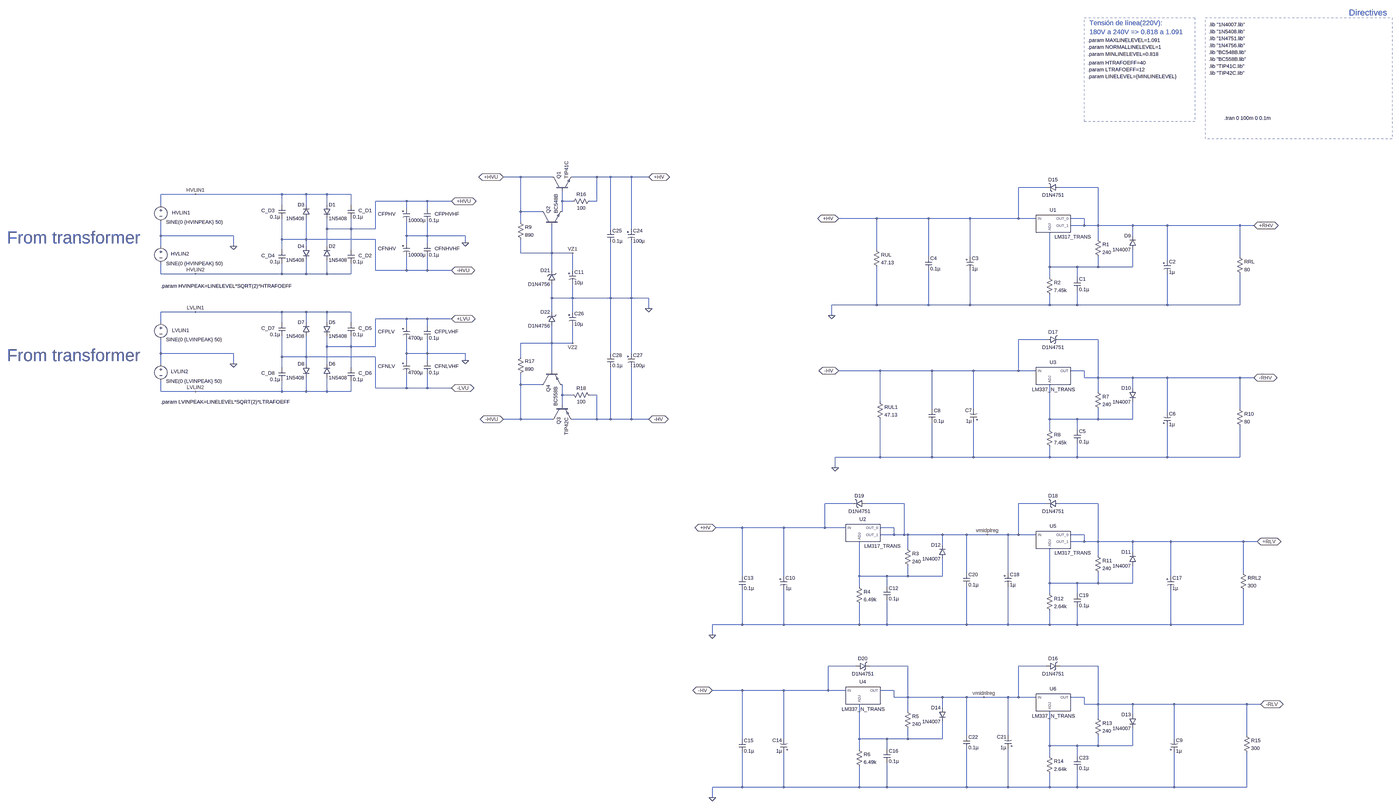
[diagram p0: schematic power_supply_V_1.0b.asc, whole sheet]
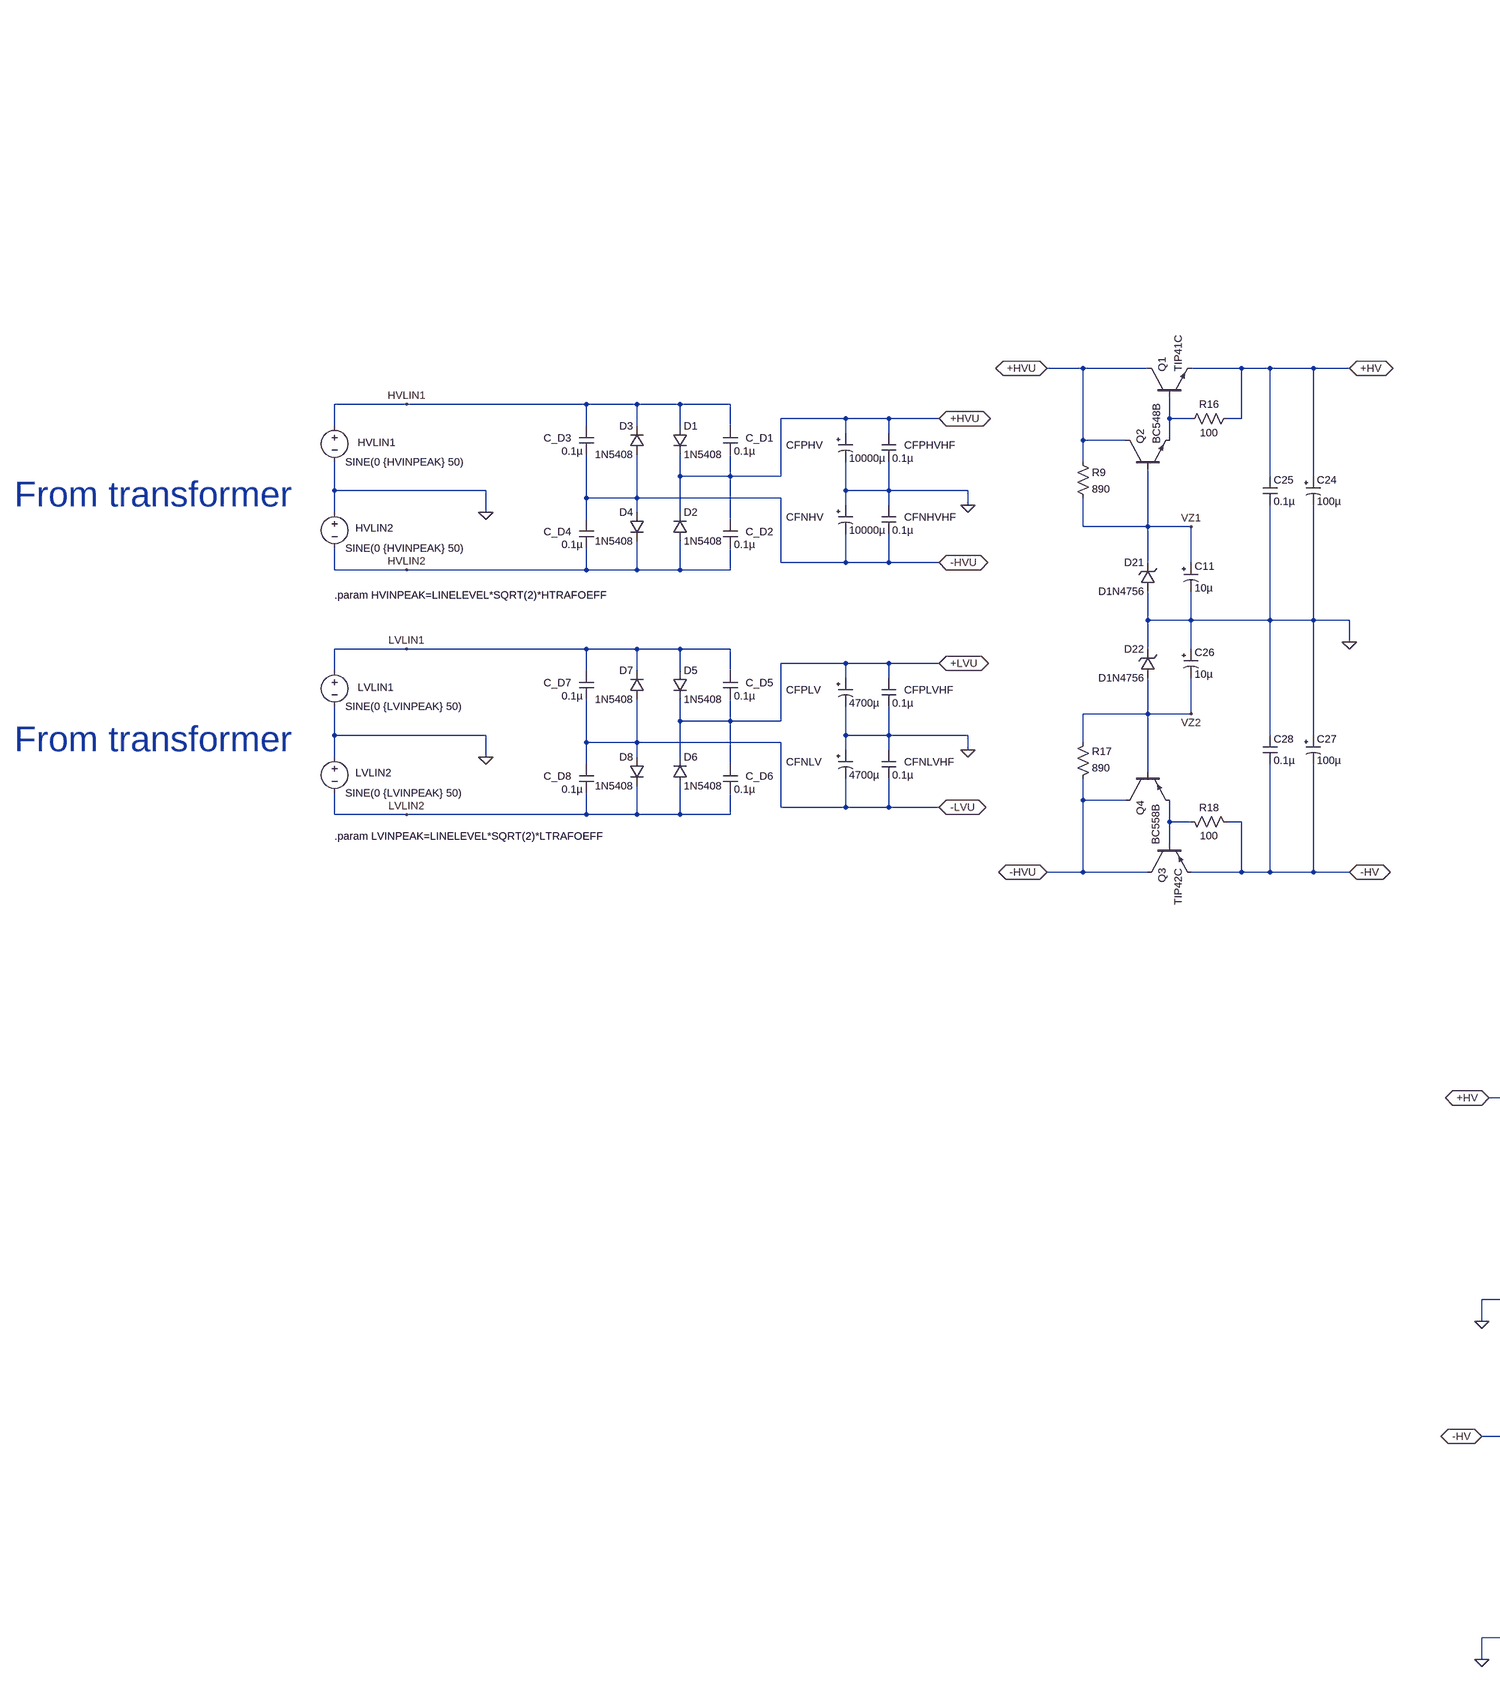
[diagram p1: schematic power_supply_V_1.0b.asc, part, row 1 of 1, column 1 of 2]
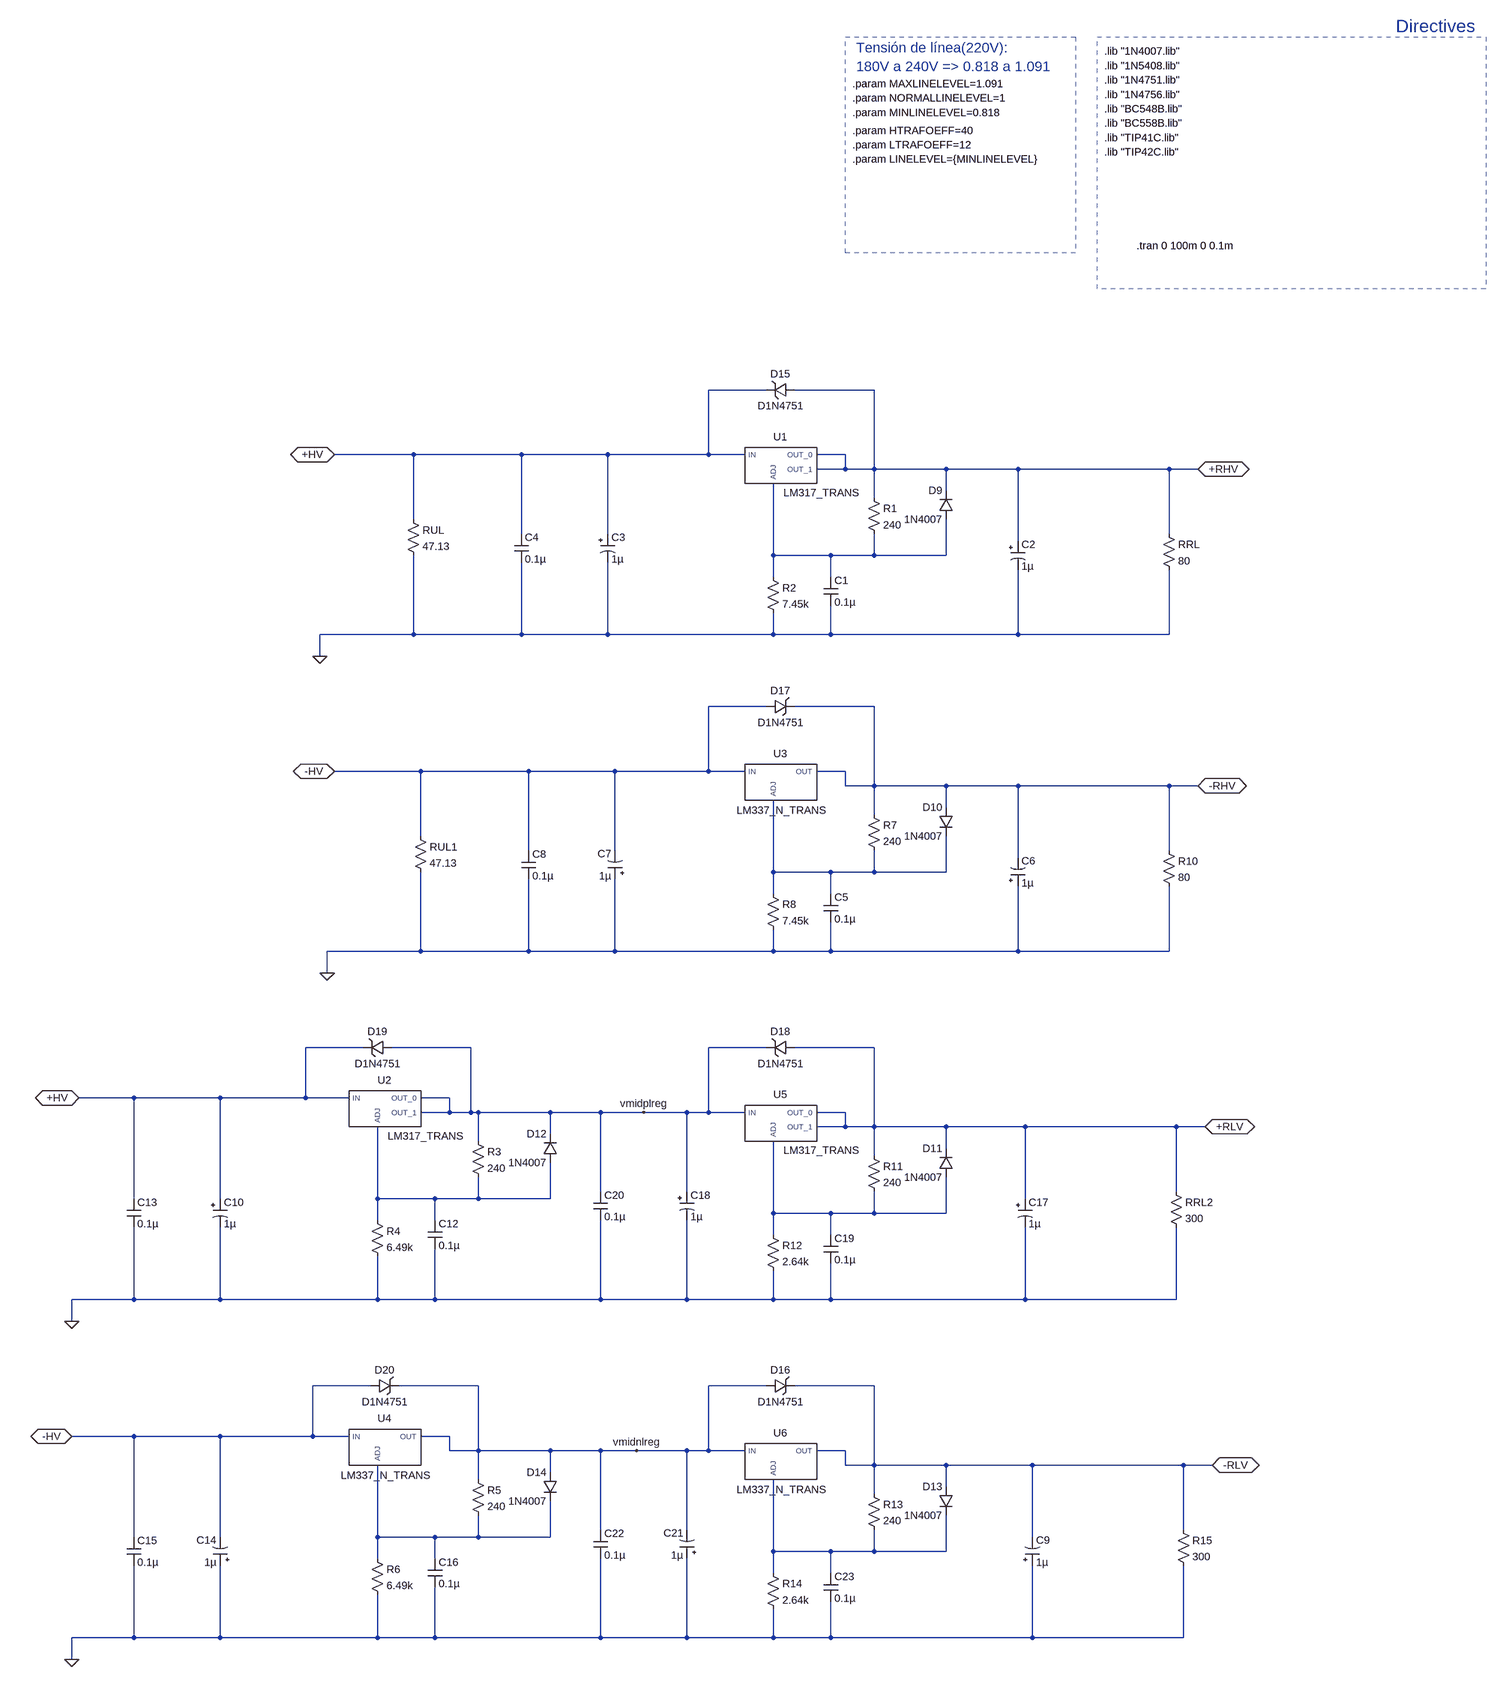
[diagram p2: schematic power_supply_V_1.0b.asc, part, row 1 of 1, column 2 of 2]
power_supply_V_1.0b.asc, the LTspice schematic file:
Version 4
SHEET 1 5728 3116
WIRE 416 -736 336 -736
WIRE 560 -736 416 -736
WIRE 768 -736 656 -736
WIRE 832 -736 768 -736
WIRE 928 -736 832 -736
WIRE 1008 -736 928 -736
WIRE 3088 -688 2960 -688
WIRE 3328 -688 3152 -688
WIRE -1088 -656 -1248 -656
WIRE -688 -656 -1088 -656
WIRE -576 -656 -688 -656
WIRE -480 -656 -576 -656
WIRE -368 -656 -480 -656
WIRE -112 -624 -256 -624
WIRE -16 -624 -112 -624
WIRE 96 -624 -16 -624
WIRE 608 -624 608 -672
WIRE 656 -624 608 -624
WIRE 768 -624 768 -736
WIRE 768 -624 736 -624
WIRE -1248 -608 -1248 -656
WIRE -688 -608 -688 -656
WIRE -576 -608 -576 -656
WIRE -480 -608 -480 -656
WIRE -368 -608 -368 -656
WIRE -112 -592 -112 -624
WIRE -16 -592 -16 -624
WIRE 416 -576 416 -736
WIRE 512 -576 416 -576
WIRE 608 -576 608 -624
WIRE 2304 -544 2128 -544
WIRE 2544 -544 2304 -544
WIRE 2736 -544 2544 -544
WIRE 2960 -544 2960 -688
WIRE 2960 -544 2736 -544
WIRE 3040 -544 2960 -544
WIRE 3264 -544 3200 -544
WIRE 416 -528 416 -576
WIRE 3264 -512 3264 -544
WIRE 3264 -512 3200 -512
WIRE 3328 -512 3328 -688
WIRE 3328 -512 3264 -512
WIRE 3488 -512 3328 -512
WIRE 3648 -512 3488 -512
WIRE 3984 -512 3648 -512
WIRE 4048 -512 3984 -512
WIRE -480 -496 -480 -544
WIRE -368 -496 -368 -544
WIRE -368 -496 -480 -496
WIRE -256 -496 -256 -624
WIRE -256 -496 -368 -496
WIRE 832 -496 832 -736
WIRE 928 -496 928 -736
WIRE -1248 -464 -1248 -528
WIRE -912 -464 -1248 -464
WIRE -112 -464 -112 -528
WIRE -16 -464 -16 -528
WIRE -16 -464 -112 -464
WIRE 160 -464 -16 -464
WIRE 3488 -464 3488 -512
WIRE -688 -448 -688 -544
WIRE -576 -448 -576 -544
WIRE -576 -448 -688 -448
WIRE -256 -448 -576 -448
WIRE 3328 -448 3328 -512
WIRE -112 -432 -112 -464
WIRE -16 -432 -16 -464
WIRE 160 -432 160 -464
WIRE -1248 -416 -1248 -464
WIRE -912 -416 -912 -464
WIRE -576 -416 -576 -448
WIRE -480 -416 -480 -496
WIRE -688 -400 -688 -448
WIRE -368 -400 -368 -496
WIRE 2304 -400 2304 -544
WIRE 416 -384 416 -448
WIRE 560 -384 560 -512
WIRE 560 -384 416 -384
WIRE 656 -384 560 -384
WIRE 2544 -368 2544 -544
WIRE 2736 -368 2736 -544
WIRE 3984 -368 3984 -512
WIRE 3648 -352 3648 -512
WIRE 3104 -320 3104 -480
WIRE 3232 -320 3104 -320
WIRE 3328 -320 3328 -368
WIRE 3328 -320 3232 -320
WIRE 3488 -320 3488 -400
WIRE 3488 -320 3328 -320
WIRE -256 -304 -256 -448
WIRE -112 -304 -112 -368
WIRE -112 -304 -256 -304
WIRE -16 -304 -16 -368
WIRE -16 -304 -112 -304
WIRE 96 -304 -16 -304
WIRE 560 -304 560 -384
WIRE 656 -304 656 -384
WIRE -1248 -288 -1248 -336
WIRE -1088 -288 -1248 -288
WIRE -688 -288 -688 -336
WIRE -688 -288 -1088 -288
WIRE -576 -288 -576 -352
WIRE -576 -288 -688 -288
WIRE -480 -288 -480 -352
WIRE -480 -288 -576 -288
WIRE -368 -288 -368 -336
WIRE -368 -288 -480 -288
WIRE 3104 -272 3104 -320
WIRE 3232 -272 3232 -320
WIRE 560 -176 560 -240
WIRE 656 -176 656 -240
WIRE 656 -176 560 -176
WIRE 832 -176 832 -432
WIRE 832 -176 656 -176
WIRE 928 -176 928 -432
WIRE 928 -176 832 -176
WIRE 1008 -176 928 -176
WIRE 2304 -144 2304 -320
WIRE 2304 -144 2096 -144
WIRE 2544 -144 2544 -304
WIRE 2544 -144 2304 -144
WIRE 2736 -144 2736 -304
WIRE 2736 -144 2544 -144
WIRE 3104 -144 3104 -192
WIRE 3104 -144 2736 -144
WIRE 3232 -144 3232 -208
WIRE 3232 -144 3104 -144
WIRE 3648 -144 3648 -288
WIRE 3648 -144 3232 -144
WIRE 3984 -144 3984 -288
WIRE 3984 -144 3648 -144
WIRE 1008 -128 1008 -176
WIRE -1088 -112 -1248 -112
WIRE -688 -112 -1088 -112
WIRE -576 -112 -688 -112
WIRE -480 -112 -576 -112
WIRE -368 -112 -480 -112
WIRE 560 -112 560 -176
WIRE 656 -112 656 -176
WIRE 2096 -96 2096 -144
WIRE -112 -80 -256 -80
WIRE -16 -80 -112 -80
WIRE 96 -80 -16 -80
WIRE -1248 -64 -1248 -112
WIRE -688 -64 -688 -112
WIRE -576 -64 -576 -112
WIRE -480 -64 -480 -112
WIRE -368 -64 -368 -112
WIRE -112 -48 -112 -80
WIRE -16 -48 -16 -80
WIRE 3088 16 2960 16
WIRE 3328 16 3152 16
WIRE 560 32 560 -48
WIRE 560 32 416 32
WIRE 656 32 656 -48
WIRE 656 32 560 32
WIRE -480 48 -480 0
WIRE -368 48 -368 0
WIRE -368 48 -480 48
WIRE -256 48 -256 -80
WIRE -256 48 -368 48
WIRE -1248 80 -1248 16
WIRE -912 80 -1248 80
WIRE -112 80 -112 16
WIRE -16 80 -16 16
WIRE -16 80 -112 80
WIRE 160 80 -16 80
WIRE 832 80 832 -176
WIRE 928 80 928 -176
WIRE -688 96 -688 0
WIRE -576 96 -576 0
WIRE -576 96 -688 96
WIRE -256 96 -576 96
WIRE 416 96 416 32
WIRE -112 112 -112 80
WIRE -16 112 -16 80
WIRE 160 112 160 80
WIRE -1248 128 -1248 80
WIRE -912 128 -912 80
WIRE -576 128 -576 96
WIRE -480 128 -480 48
WIRE -688 144 -688 96
WIRE -368 144 -368 48
WIRE 560 160 560 32
WIRE 2320 160 2128 160
WIRE 2560 160 2320 160
WIRE 2752 160 2560 160
WIRE 2960 160 2960 16
WIRE 2960 160 2752 160
WIRE 3040 160 2960 160
WIRE 3264 160 3200 160
WIRE 3264 192 3264 160
WIRE 3328 192 3328 16
WIRE 3328 192 3264 192
WIRE 3488 192 3328 192
WIRE 3648 192 3488 192
WIRE 3984 192 3648 192
WIRE 4048 192 3984 192
WIRE 416 224 416 176
WIRE 512 224 416 224
WIRE -256 240 -256 96
WIRE -112 240 -112 176
WIRE -112 240 -256 240
WIRE -16 240 -16 176
WIRE -16 240 -112 240
WIRE 96 240 -16 240
WIRE 3488 240 3488 192
WIRE -1248 256 -1248 208
WIRE -1088 256 -1248 256
WIRE -688 256 -688 208
WIRE -688 256 -1088 256
WIRE -576 256 -576 192
WIRE -576 256 -688 256
WIRE -480 256 -480 192
WIRE -480 256 -576 256
WIRE -368 256 -368 208
WIRE -368 256 -480 256
WIRE 3328 256 3328 192
WIRE 608 272 608 224
WIRE 656 272 608 272
WIRE 768 272 736 272
WIRE 2320 304 2320 160
WIRE 608 320 608 272
WIRE 2560 336 2560 160
WIRE 2752 336 2752 160
WIRE 3984 336 3984 192
WIRE 3648 352 3648 192
WIRE 416 384 416 224
WIRE 416 384 336 384
WIRE 560 384 416 384
WIRE 768 384 768 272
WIRE 768 384 656 384
WIRE 832 384 832 144
WIRE 832 384 768 384
WIRE 928 384 928 144
WIRE 928 384 832 384
WIRE 1008 384 928 384
WIRE 3104 384 3104 224
WIRE 3232 384 3104 384
WIRE 3328 384 3328 336
WIRE 3328 384 3232 384
WIRE 3488 384 3488 304
WIRE 3488 384 3328 384
WIRE 3104 432 3104 384
WIRE 3232 432 3232 384
WIRE 2320 560 2320 384
WIRE 2320 560 2112 560
WIRE 2560 560 2560 400
WIRE 2560 560 2320 560
WIRE 2752 560 2752 400
WIRE 2752 560 2560 560
WIRE 3104 560 3104 512
WIRE 3104 560 2752 560
WIRE 3232 560 3232 496
WIRE 3232 560 3104 560
WIRE 3648 560 3648 416
WIRE 3648 560 3232 560
WIRE 3984 560 3984 416
WIRE 3984 560 3648 560
WIRE 2112 608 2112 560
WIRE 2192 864 2064 864
WIRE 2432 864 2256 864
WIRE 3088 864 2960 864
WIRE 3328 864 3152 864
WIRE 1664 976 1472 976
WIRE 1856 976 1664 976
WIRE 2064 976 2064 864
WIRE 2064 976 1856 976
WIRE 2160 976 2064 976
WIRE 2384 976 2320 976
WIRE 2384 1008 2384 976
WIRE 2384 1008 2320 1008
WIRE 2432 1008 2432 864
WIRE 2432 1008 2384 1008
WIRE 2448 1008 2432 1008
WIRE 2608 1008 2448 1008
WIRE 2720 1008 2608 1008
WIRE 2816 1008 2720 1008
WIRE 2912 1008 2816 1008
WIRE 2960 1008 2960 864
WIRE 2960 1008 2912 1008
WIRE 3040 1008 2960 1008
WIRE 3264 1008 3200 1008
WIRE 3264 1040 3264 1008
WIRE 3264 1040 3200 1040
WIRE 3328 1040 3328 864
WIRE 3328 1040 3264 1040
WIRE 3488 1040 3328 1040
WIRE 3664 1040 3488 1040
WIRE 4000 1040 3664 1040
WIRE 4064 1040 4000 1040
WIRE 2608 1056 2608 1008
WIRE 2448 1072 2448 1008
WIRE 3488 1088 3488 1040
WIRE 3328 1104 3328 1040
WIRE 2720 1184 2720 1008
WIRE 2912 1184 2912 1008
WIRE 4000 1184 4000 1040
WIRE 1664 1200 1664 976
WIRE 1856 1200 1856 976
WIRE 2224 1200 2224 1040
WIRE 2352 1200 2224 1200
WIRE 2448 1200 2448 1152
WIRE 2448 1200 2352 1200
WIRE 2608 1200 2608 1120
WIRE 2608 1200 2448 1200
WIRE 3664 1200 3664 1040
WIRE 3104 1232 3104 1072
WIRE 3232 1232 3104 1232
WIRE 3328 1232 3328 1184
WIRE 3328 1232 3232 1232
WIRE 3488 1232 3488 1152
WIRE 3488 1232 3328 1232
WIRE 2224 1248 2224 1200
WIRE 2352 1248 2352 1200
WIRE 3104 1280 3104 1232
WIRE 3232 1280 3232 1232
WIRE 1664 1424 1664 1264
WIRE 1664 1424 1456 1424
WIRE 1856 1424 1856 1264
WIRE 1856 1424 1664 1424
WIRE 2224 1424 2224 1328
WIRE 2224 1424 1856 1424
WIRE 2352 1424 2352 1312
WIRE 2352 1424 2224 1424
WIRE 2720 1424 2720 1248
WIRE 2720 1424 2352 1424
WIRE 2912 1424 2912 1248
WIRE 2912 1424 2720 1424
WIRE 3104 1424 3104 1360
WIRE 3104 1424 2912 1424
WIRE 3232 1424 3232 1344
WIRE 3232 1424 3104 1424
WIRE 3664 1424 3664 1264
WIRE 3664 1424 3232 1424
WIRE 4000 1424 4000 1264
WIRE 4000 1424 3664 1424
WIRE 1456 1472 1456 1424
WIRE 2208 1616 2080 1616
WIRE 2448 1616 2272 1616
WIRE 3088 1616 2960 1616
WIRE 3328 1616 3152 1616
WIRE 1664 1728 1456 1728
WIRE 1856 1728 1664 1728
WIRE 2080 1728 2080 1616
WIRE 2080 1728 1856 1728
WIRE 2160 1728 2080 1728
WIRE 2384 1728 2320 1728
WIRE 2384 1760 2384 1728
WIRE 2448 1760 2448 1616
WIRE 2448 1760 2384 1760
WIRE 2608 1760 2448 1760
WIRE 2720 1760 2608 1760
WIRE 2800 1760 2720 1760
WIRE 2912 1760 2800 1760
WIRE 2960 1760 2960 1616
WIRE 2960 1760 2912 1760
WIRE 3040 1760 2960 1760
WIRE 3264 1760 3200 1760
WIRE 3264 1792 3264 1760
WIRE 3328 1792 3328 1616
WIRE 3328 1792 3264 1792
WIRE 3488 1792 3328 1792
WIRE 3680 1792 3488 1792
WIRE 4016 1792 3680 1792
WIRE 4080 1792 4016 1792
WIRE 2608 1808 2608 1760
WIRE 2448 1824 2448 1760
WIRE 3488 1840 3488 1792
WIRE 3328 1856 3328 1792
WIRE 2720 1936 2720 1760
WIRE 2912 1936 2912 1760
WIRE 4016 1936 4016 1792
WIRE 1664 1952 1664 1728
WIRE 1856 1952 1856 1728
WIRE 2224 1952 2224 1792
WIRE 2352 1952 2224 1952
WIRE 2448 1952 2448 1904
WIRE 2448 1952 2352 1952
WIRE 2608 1952 2608 1872
WIRE 2608 1952 2448 1952
WIRE 3680 1952 3680 1792
WIRE 3104 1984 3104 1824
WIRE 3232 1984 3104 1984
WIRE 3328 1984 3328 1936
WIRE 3328 1984 3232 1984
WIRE 3488 1984 3488 1904
WIRE 3488 1984 3328 1984
WIRE 2224 2000 2224 1952
WIRE 2352 2000 2352 1952
WIRE 3104 2032 3104 1984
WIRE 3232 2032 3232 1984
WIRE 1664 2176 1664 2016
WIRE 1664 2176 1456 2176
WIRE 1856 2176 1856 2016
WIRE 1856 2176 1664 2176
WIRE 2224 2176 2224 2080
WIRE 2224 2176 1856 2176
WIRE 2352 2176 2352 2064
WIRE 2352 2176 2224 2176
WIRE 2720 2176 2720 2000
WIRE 2720 2176 2352 2176
WIRE 2912 2176 2912 2000
WIRE 2912 2176 2720 2176
WIRE 3104 2176 3104 2112
WIRE 3104 2176 2912 2176
WIRE 3232 2176 3232 2096
WIRE 3232 2176 3104 2176
WIRE 3680 2176 3680 2016
WIRE 3680 2176 3232 2176
WIRE 4016 2176 4016 2016
WIRE 4016 2176 3680 2176
WIRE 1456 2224 1456 2176
FLAG -1088 -656 HVLIN1
FLAG -1088 -288 HVLIN2
FLAG -912 -416 0
FLAG 96 -624 +HVU
IOPIN 96 -624 BiDir
FLAG 2128 -544 +HV
IOPIN 2128 -544 BiDir
FLAG 96 -304 -HVU
IOPIN 96 -304 BiDir
FLAG 2128 160 -HV
IOPIN 2128 160 BiDir
FLAG 1456 1728 -HV
IOPIN 1456 1728 BiDir
FLAG 1472 976 +HV
IOPIN 1472 976 BiDir
FLAG 160 -432 0
FLAG 2816 1008 vmidplreg
FLAG 2800 1760 vmidnlreg
FLAG -1088 -112 LVLIN1
FLAG -1088 256 LVLIN2
FLAG -912 128 0
FLAG 96 -80 +LVU
IOPIN 96 -80 BiDir
FLAG 96 240 -LVU
IOPIN 96 240 BiDir
FLAG 160 112 0
FLAG 2096 -96 0
FLAG 4048 -512 +RHV
IOPIN 4048 -512 BiDir
FLAG 2112 608 0
FLAG 4048 192 -RHV
IOPIN 4048 192 BiDir
FLAG 1456 1472 0
FLAG 4064 1040 +RLV
IOPIN 4064 1040 BiDir
FLAG 1456 2224 0
FLAG 4080 1792 -RLV
IOPIN 4080 1792 BiDir
FLAG 336 -736 +HVU
IOPIN 336 -736 BiDir
FLAG 1008 -736 +HV
IOPIN 1008 -736 BiDir
FLAG 656 -384 VZ1
FLAG 336 384 -HVU
IOPIN 336 384 BiDir
FLAG 1008 384 -HV
IOPIN 1008 384 BiDir
FLAG 656 32 VZ2
FLAG 1008 -128 0
SYMBOL voltage -1248 -624 R0
WINDOW 123 0 0 Left 2
WINDOW 39 0 0 Left 2
WINDOW 0 51 53 Left 2
SYMATTR InstName HVLIN1
SYMATTR Value SINE(0 {HVINPEAK} 50)
SYMBOL diode -496 -608 R0
SYMATTR InstName D1
SYMATTR Value 1N5408
SYMBOL diode -496 -352 M180
WINDOW 0 24 64 Left 2
WINDOW 3 24 0 Left 2
SYMATTR InstName D2
SYMATTR Value 1N5408
SYMBOL polcap -128 -592 R0
WINDOW 0 -116 27 Left 2
WINDOW 3 24 56 Left 2
SYMATTR InstName CFPHV
SYMATTR Value 10000µ
SYMATTR Description Capacitor
SYMATTR Type cap
SYMATTR SpiceLine V=35 Irms=1.45 Rser=0.044 Lser=0 mfg="Nichicon" pn="UPR1V222MRH" type="Al electrolytic"
SYMBOL cap -32 -592 R0
WINDOW 0 50 27 Left 2
SYMATTR InstName CFPHVHF
SYMATTR Value 0.1µ
SYMATTR SpiceLine V=4 Irms=1.62 Rser=0.0464862 Lser=0 mfg="KEMET" pn="C0402C104K7PAC" type="X5R"
SYMBOL diode -560 -544 R180
WINDOW 0 24 64 Left 2
WINDOW 3 24 0 Left 2
SYMATTR InstName D3
SYMATTR Value 1N5408
SYMBOL diode -560 -416 M0
SYMATTR InstName D4
SYMATTR Value 1N5408
SYMBOL voltage -1248 -432 R0
WINDOW 123 0 0 Left 2
WINDOW 39 0 0 Left 2
WINDOW 0 46 51 Left 2
SYMATTR InstName HVLIN2
SYMATTR Value SINE(0 {HVINPEAK} 50)
SYMBOL polcap -128 -432 R0
WINDOW 0 -116 27 Left 2
WINDOW 3 24 56 Left 2
SYMATTR InstName CFNHV
SYMATTR Value 10000µ
SYMATTR Description Capacitor
SYMATTR Type cap
SYMATTR SpiceLine V=35 Irms=1.45 Rser=0.044 Lser=0 mfg="Nichicon" pn="UPR1V222MRH" type="Al electrolytic"
SYMBOL cap -32 -432 R0
WINDOW 0 50 27 Left 2
SYMATTR InstName CFNHVHF
SYMATTR Value 0.1µ
SYMATTR SpiceLine V=4 Irms=1.62 Rser=0.0464862 Lser=0 mfg="KEMET" pn="C0402C104K7PAC" type="X5R"
SYMBOL LM317_TRANS 3120 -528 R0
WINDOW 3 91 53 Top 2
SYMATTR InstName U1
SYMBOL diode 3504 -400 R180
WINDOW 0 24 64 Left 2
WINDOW 3 24 0 Left 2
SYMATTR InstName D9
SYMATTR Value 1N4007
SYMBOL res 3312 -464 R0
SYMATTR InstName R1
SYMATTR Value 240
SYMBOL res 3088 -288 R0
SYMATTR InstName R2
SYMATTR Value 7.45k
SYMBOL polcap 3632 -352 R0
SYMATTR InstName C2
SYMATTR Value 1µ
SYMBOL polcap 2720 -368 R0
SYMATTR InstName C3
SYMATTR Value 1µ
SYMBOL diode 3504 240 M0
SYMATTR InstName D10
SYMATTR Value 1N4007
SYMBOL res 3312 240 R0
SYMATTR InstName R7
SYMATTR Value 240
SYMBOL res 3088 416 R0
SYMATTR InstName R8
SYMATTR Value 7.45k
SYMBOL polcap 3632 416 M180
WINDOW 0 24 57 Left 2
WINDOW 3 24 8 Left 2
SYMATTR InstName C6
SYMATTR Value 1µ
SYMBOL res 3968 320 R0
SYMATTR InstName R10
SYMATTR Value 80
SYMBOL LM337_N_TRANS 3120 176 R0
SYMATTR InstName U3
SYMBOL res 3968 -384 R0
SYMATTR InstName RRL
SYMATTR Value 80
SYMBOL cap 3216 -272 R0
SYMATTR InstName C1
SYMATTR Value 0.1µ
SYMBOL cap 2528 -368 R0
SYMATTR InstName C4
SYMATTR Value 0.1µ
SYMBOL res 2288 -416 R0
SYMATTR InstName RUL
SYMATTR Value 47.13
SYMBOL polcap 2768 400 R180
WINDOW 0 24 57 Left 2
WINDOW 3 24 8 Left 2
SYMATTR InstName C7
SYMATTR Value 1µ
SYMBOL cap 2544 336 R0
SYMATTR InstName C8
SYMATTR Value 0.1µ
SYMBOL res 2304 288 R0
SYMATTR InstName RUL1
SYMATTR Value 47.13
SYMBOL cap 3216 432 R0
SYMATTR InstName C5
SYMATTR Value 0.1µ
SYMBOL LM317_TRANS 2240 992 R0
WINDOW 3 91 53 Top 2
SYMATTR InstName U2
SYMBOL diode 2624 1120 R180
WINDOW 0 24 64 Left 2
WINDOW 3 24 0 Left 2
SYMATTR InstName D12
SYMATTR Value 1N4007
SYMBOL res 2432 1056 R0
SYMATTR InstName R3
SYMATTR Value 240
SYMBOL res 2208 1232 R0
SYMATTR InstName R4
SYMATTR Value 6.49k
SYMBOL polcap 1840 1200 R0
SYMATTR InstName C10
SYMATTR Value 1µ
SYMBOL diode 2624 1808 M0
SYMATTR InstName D14
SYMATTR Value 1N4007
SYMBOL res 2432 1808 R0
SYMATTR InstName R5
SYMATTR Value 240
SYMBOL res 2208 1984 R0
SYMATTR InstName R6
SYMATTR Value 6.49k
SYMBOL LM337_N_TRANS 2240 1744 R0
SYMATTR InstName U4
SYMBOL cap 2336 1248 R0
SYMATTR InstName C12
SYMATTR Value 0.1µ
SYMBOL cap 1648 1200 R0
SYMATTR InstName C13
SYMATTR Value 0.1µ
SYMBOL polcap 1872 2016 R180
WINDOW 0 24 57 Left 2
WINDOW 3 24 8 Left 2
SYMATTR InstName C14
SYMATTR Value 1µ
SYMBOL cap 1648 1952 R0
SYMATTR InstName C15
SYMATTR Value 0.1µ
SYMBOL cap 2336 2000 R0
SYMATTR InstName C16
SYMATTR Value 0.1µ
SYMBOL LM317_TRANS 3120 1024 R0
WINDOW 3 91 53 Top 2
SYMATTR InstName U5
SYMBOL diode 3504 1152 R180
WINDOW 0 24 64 Left 2
WINDOW 3 24 0 Left 2
SYMATTR InstName D11
SYMATTR Value 1N4007
SYMBOL res 3312 1088 R0
SYMATTR InstName R11
SYMATTR Value 240
SYMBOL res 3088 1264 R0
SYMATTR InstName R12
SYMATTR Value 2.64k
SYMBOL polcap 3648 1200 R0
SYMATTR InstName C17
SYMATTR Value 1µ
SYMBOL polcap 2896 1184 R0
SYMATTR InstName C18
SYMATTR Value 1µ
SYMBOL res 3984 1168 R0
SYMATTR InstName RRL2
SYMATTR Value 300
SYMBOL cap 3216 1280 R0
SYMATTR InstName C19
SYMATTR Value 0.1µ
SYMBOL cap 2704 1184 R0
SYMATTR InstName C20
SYMATTR Value 0.1µ
SYMBOL diode 3504 1840 M0
SYMATTR InstName D13
SYMATTR Value 1N4007
SYMBOL res 3312 1840 R0
SYMATTR InstName R13
SYMATTR Value 240
SYMBOL res 3088 2016 R0
SYMATTR InstName R14
SYMATTR Value 2.64k
SYMBOL polcap 3664 2016 M180
WINDOW 0 24 57 Left 2
WINDOW 3 24 8 Left 2
SYMATTR InstName C9
SYMATTR Value 1µ
SYMBOL res 4000 1920 R0
SYMATTR InstName R15
SYMATTR Value 300
SYMBOL LM337_N_TRANS 3120 1776 R0
SYMATTR InstName U6
SYMBOL polcap 2928 2000 R180
WINDOW 0 24 57 Left 2
WINDOW 3 24 8 Left 2
SYMATTR InstName C21
SYMATTR Value 1µ
SYMBOL cap 2704 1936 R0
SYMATTR InstName C22
SYMATTR Value 0.1µ
SYMBOL cap 3216 2032 R0
SYMATTR InstName C23
SYMATTR Value 0.1µ
SYMBOL cap -384 -608 R0
WINDOW 0 50 27 Left 2
SYMATTR InstName C_D1
SYMATTR Value 0.1µ
SYMATTR SpiceLine V=4 Irms=1.62 Rser=0.0464862 Lser=0 mfg="KEMET" pn="C0402C104K7PAC" type="X5R"
SYMBOL cap -384 -400 R0
WINDOW 0 50 27 Left 2
SYMATTR InstName C_D2
SYMATTR Value 0.1µ
SYMATTR SpiceLine V=4 Irms=1.62 Rser=0.0464862 Lser=0 mfg="KEMET" pn="C0402C104K7PAC" type="X5R"
SYMBOL cap -672 -608 M0
WINDOW 0 50 27 Left 2
SYMATTR InstName C_D3
SYMATTR Value 0.1µ
SYMATTR SpiceLine V=4 Irms=1.62 Rser=0.0464862 Lser=0 mfg="KEMET" pn="C0402C104K7PAC" type="X5R"
SYMBOL cap -672 -400 M0
WINDOW 0 50 27 Left 2
SYMATTR InstName C_D4
SYMATTR Value 0.1µ
SYMATTR SpiceLine V=4 Irms=1.62 Rser=0.0464862 Lser=0 mfg="KEMET" pn="C0402C104K7PAC" type="X5R"
SYMBOL voltage -1248 -80 R0
WINDOW 123 0 0 Left 2
WINDOW 39 0 0 Left 2
WINDOW 0 51 53 Left 2
SYMATTR InstName LVLIN1
SYMATTR Value SINE(0 {LVINPEAK} 50)
SYMBOL diode -496 -64 R0
SYMATTR InstName D5
SYMATTR Value 1N5408
SYMBOL diode -496 192 M180
WINDOW 0 24 64 Left 2
WINDOW 3 24 0 Left 2
SYMATTR InstName D6
SYMATTR Value 1N5408
SYMBOL polcap -128 -48 R0
WINDOW 0 -116 27 Left 2
WINDOW 3 24 56 Left 2
SYMATTR InstName CFPLV
SYMATTR Value 4700µ
SYMATTR Description Capacitor
SYMATTR Type cap
SYMATTR SpiceLine V=35 Irms=1.45 Rser=0.044 Lser=0 mfg="Nichicon" pn="UPR1V222MRH" type="Al electrolytic"
SYMBOL cap -32 -48 R0
WINDOW 0 50 27 Left 2
SYMATTR InstName CFPLVHF
SYMATTR Value 0.1µ
SYMATTR SpiceLine V=4 Irms=1.62 Rser=0.0464862 Lser=0 mfg="KEMET" pn="C0402C104K7PAC" type="X5R"
SYMBOL diode -560 0 R180
WINDOW 0 24 64 Left 2
WINDOW 3 24 0 Left 2
SYMATTR InstName D7
SYMATTR Value 1N5408
SYMBOL diode -560 128 M0
SYMATTR InstName D8
SYMATTR Value 1N5408
SYMBOL voltage -1248 112 R0
WINDOW 123 0 0 Left 2
WINDOW 39 0 0 Left 2
WINDOW 0 46 51 Left 2
SYMATTR InstName LVLIN2
SYMATTR Value SINE(0 {LVINPEAK} 50)
SYMBOL polcap -128 112 R0
WINDOW 0 -116 27 Left 2
WINDOW 3 24 56 Left 2
SYMATTR InstName CFNLV
SYMATTR Value 4700µ
SYMATTR Description Capacitor
SYMATTR Type cap
SYMATTR SpiceLine V=35 Irms=1.45 Rser=0.044 Lser=0 mfg="Nichicon" pn="UPR1V222MRH" type="Al electrolytic"
SYMBOL cap -32 112 R0
WINDOW 0 50 27 Left 2
SYMATTR InstName CFNLVHF
SYMATTR Value 0.1µ
SYMATTR SpiceLine V=4 Irms=1.62 Rser=0.0464862 Lser=0 mfg="KEMET" pn="C0402C104K7PAC" type="X5R"
SYMBOL cap -384 -64 R0
WINDOW 0 50 27 Left 2
SYMATTR InstName C_D5
SYMATTR Value 0.1µ
SYMATTR SpiceLine V=4 Irms=1.62 Rser=0.0464862 Lser=0 mfg="KEMET" pn="C0402C104K7PAC" type="X5R"
SYMBOL cap -384 144 R0
WINDOW 0 50 27 Left 2
SYMATTR InstName C_D6
SYMATTR Value 0.1µ
SYMATTR SpiceLine V=4 Irms=1.62 Rser=0.0464862 Lser=0 mfg="KEMET" pn="C0402C104K7PAC" type="X5R"
SYMBOL cap -672 -64 M0
WINDOW 0 50 27 Left 2
SYMATTR InstName C_D7
SYMATTR Value 0.1µ
SYMATTR SpiceLine V=4 Irms=1.62 Rser=0.0464862 Lser=0 mfg="KEMET" pn="C0402C104K7PAC" type="X5R"
SYMBOL cap -672 144 M0
WINDOW 0 50 27 Left 2
SYMATTR InstName C_D8
SYMATTR Value 0.1µ
SYMATTR SpiceLine V=4 Irms=1.62 Rser=0.0464862 Lser=0 mfg="KEMET" pn="C0402C104K7PAC" type="X5R"
SYMBOL npn 560 -672 R270
SYMATTR InstName Q1
SYMATTR Value TIP41C
SYMBOL zener 3152 -704 R90
WINDOW 0 -4 32 VBottom 2
WINDOW 3 36 32 VTop 2
SYMATTR InstName D15
SYMATTR Value D1N4751
SYMBOL zener 3088 0 M90
WINDOW 0 -4 32 VBottom 2
WINDOW 3 36 32 VTop 2
SYMATTR InstName D17
SYMATTR Value D1N4751
SYMBOL zener 3152 848 R90
WINDOW 0 -4 32 VBottom 2
WINDOW 3 36 32 VTop 2
SYMATTR InstName D18
SYMATTR Value D1N4751
SYMBOL zener 2256 848 R90
WINDOW 0 -4 32 VBottom 2
WINDOW 3 36 32 VTop 2
SYMATTR InstName D19
SYMATTR Value D1N4751
SYMBOL zener 3088 1600 M90
WINDOW 0 -4 32 VBottom 2
WINDOW 3 36 32 VTop 2
SYMATTR InstName D16
SYMATTR Value D1N4751
SYMBOL zener 2208 1600 M90
WINDOW 0 -4 32 VBottom 2
WINDOW 3 36 32 VTop 2
SYMATTR InstName D20
SYMATTR Value D1N4751
SYMBOL zener 576 -240 R180
WINDOW 0 24 64 Left 2
WINDOW 3 24 0 Left 2
SYMATTR InstName D21
SYMATTR Value D1N4756
SYMBOL res 400 -544 R0
SYMATTR InstName R9
SYMATTR Value 890
SYMBOL npn 512 -512 R270
SYMATTR InstName Q2
SYMATTR Value BC548B
SYMBOL res 752 -640 R90
WINDOW 0 0 56 VBottom 2
WINDOW 3 32 56 VTop 2
SYMATTR InstName R16
SYMATTR Value 100
SYMBOL polcap 640 -304 R0
SYMATTR InstName C11
SYMATTR Value 10µ
SYMBOL polcap 912 -496 R0
SYMATTR InstName C24
SYMATTR Value 100µ
SYMBOL cap 816 -496 R0
SYMATTR InstName C25
SYMATTR Value 0.1µ
SYMBOL zener 576 -48 R180
WINDOW 0 24 64 Left 2
WINDOW 3 24 0 Left 2
SYMATTR InstName D22
SYMATTR Value D1N4756
SYMBOL res 400 192 M180
WINDOW 0 36 76 Left 2
WINDOW 3 36 40 Left 2
SYMATTR InstName R17
SYMATTR Value 890
SYMBOL res 752 288 M270
WINDOW 0 32 56 VTop 2
WINDOW 3 0 56 VBottom 2
SYMATTR InstName R18
SYMATTR Value 100
SYMBOL polcap 640 -112 R0
SYMATTR InstName C26
SYMATTR Value 10µ
SYMBOL polcap 912 80 R0
SYMATTR InstName C27
SYMATTR Value 100µ
SYMBOL cap 816 144 M180
WINDOW 0 24 56 Left 2
WINDOW 3 24 8 Left 2
SYMATTR InstName C28
SYMATTR Value 0.1µ
SYMBOL pnp 512 160 M90
WINDOW 0 66 32 Left 2
WINDOW 3 73 66 Left 2
SYMATTR InstName Q4
SYMATTR Value BC558B
SYMBOL pnp 560 320 M90
SYMATTR InstName Q3
SYMATTR Value TIP42C
TEXT -1960 -456 Left 6 ;From transformer
TEXT 3912 -1232 Left 2 !.tran 0 100m 0 0.1m
TEXT 3840 -1664 Left 2 !.lib "1N4007.lib"
TEXT 4488 -1720 Left 4 ;Directives
TEXT 3840 -1632 Left 2 !.lib "1N5408.lib"
TEXT 3840 -1600 Left 2 !.lib "1N4751.lib"
TEXT 3280 -1488 Left 2 !.param HTRAFOEFF=40
TEXT 3280 -1456 Left 2 !.param LTRAFOEFF=12
TEXT 3280 -1424 Left 2 !.param LINELEVEL={MINLINELEVEL}
TEXT 3288 -1672 Left 3 ;Tensión de línea(220V):\n180V a 240V => 0.818 a 1.091
TEXT 3280 -1592 Left 2 !.param MAXLINELEVEL=1.091
TEXT 3280 -1528 Left 2 !.param MINLINELEVEL=0.818
TEXT 3280 -1560 Left 2 !.param NORMALLINELEVEL=1
TEXT -1248 -232 Left 2 !.param HVINPEAK=LINELEVEL*SQRT(2)*HTRAFOEFF
TEXT -1960 88 Left 6 ;From transformer
TEXT -1248 304 Left 2 !.param LVINPEAK=LINELEVEL*SQRT(2)*LTRAFOEFF
TEXT 3840 -1568 Left 2 !.lib "1N4756.lib"
TEXT 3840 -1536 Left 2 !.lib "BC548B.lib"
TEXT 3840 -1504 Left 2 !.lib "BC558B.lib"
TEXT 3840 -1472 Left 2 !.lib "TIP41C.lib"
TEXT 3840 -1440 Left 2 !.lib "TIP42C.lib"
RECTANGLE Normal 4688 -1136 3824 -1696 3
RECTANGLE Normal 3776 -1216 3264 -1696 2

The netlist it stands for:
* power_supply_V_1.0b.asc
V§HVLIN1 HVLIN1 0 SINE(0 {HVINPEAK} 50)
D1 HVLIN1 +HVU 1N5408
D2 HVLIN2 +HVU 1N5408
CFPHV +HVU 0 10000µ V=35 Irms=1.45 Rser=0.044 Lser=0 mfg="Nichicon" pn="UPR1V222MRH" type="Al electrolytic"
CFPHVHF +HVU 0 0.1µ V=4 Irms=1.62 Rser=0.0464862 Lser=0 mfg="KEMET" pn="C0402C104K7PAC" type="X5R"
D3 -HVU HVLIN1 1N5408
D4 -HVU HVLIN2 1N5408
V§HVLIN2 0 HVLIN2 SINE(0 {HVINPEAK} 50)
CFNHV 0 -HVU 10000µ V=35 Irms=1.45 Rser=0.044 Lser=0 mfg="Nichicon" pn="UPR1V222MRH" type="Al electrolytic"
CFNHVHF 0 -HVU 0.1µ V=4 Irms=1.62 Rser=0.0464862 Lser=0 mfg="KEMET" pn="C0402C104K7PAC" type="X5R"
XU1 +HV N002 +RHV +RHV LM317_TRANS  ; pins IN ADJ OUT_0 OUT_1
D9 N002 +RHV 1N4007
R1 +RHV N002 240
R2 N002 0 7.45k
C2 +RHV 0 1µ
C3 +HV 0 1µ
D10 -RHV N004 1N4007
R7 -RHV N004 240
R8 N004 0 7.45k
C6 0 -RHV 1µ
R10 -RHV 0 80
XU3 -HV N004 -RHV LM337_N_TRANS  ; pins IN ADJ OUT
RRL +RHV 0 80
C1 N002 0 0.1µ
C4 +HV 0 0.1µ
RUL +HV 0 47.13
C7 0 -HV 1µ
C8 -HV 0 0.1µ
RUL1 -HV 0 47.13
C5 N004 0 0.1µ
XU2 +HV N005 vmidplreg vmidplreg LM317_TRANS  ; pins IN ADJ OUT_0 OUT_1
D12 N005 vmidplreg 1N4007
R3 vmidplreg N005 240
R4 N005 0 6.49k
C10 +HV 0 1µ
D14 vmidnlreg N007 1N4007
R5 vmidnlreg N007 240
R6 N007 0 6.49k
XU4 -HV N007 vmidnlreg LM337_N_TRANS  ; pins IN ADJ OUT
C12 N005 0 0.1µ
C13 +HV 0 0.1µ
C14 0 -HV 1µ
C15 -HV 0 0.1µ
C16 N007 0 0.1µ
XU5 vmidplreg N006 +RLV +RLV LM317_TRANS  ; pins IN ADJ OUT_0 OUT_1
D11 N006 +RLV 1N4007
R11 +RLV N006 240
R12 N006 0 2.64k
C17 +RLV 0 1µ
C18 vmidplreg 0 1µ
RRL2 +RLV 0 300
C19 N006 0 0.1µ
C20 vmidplreg 0 0.1µ
D13 -RLV N008 1N4007
R13 -RLV N008 240
R14 N008 0 2.64k
C9 0 -RLV 1µ
R15 -RLV 0 300
XU6 vmidnlreg N008 -RLV LM337_N_TRANS  ; pins IN ADJ OUT
C21 0 vmidnlreg 1µ
C22 vmidnlreg 0 0.1µ
C23 N008 0 0.1µ
C_D1 HVLIN1 +HVU 0.1µ V=4 Irms=1.62 Rser=0.0464862 Lser=0 mfg="KEMET" pn="C0402C104K7PAC" type="X5R"
C_D2 +HVU HVLIN2 0.1µ V=4 Irms=1.62 Rser=0.0464862 Lser=0 mfg="KEMET" pn="C0402C104K7PAC" type="X5R"
C_D3 HVLIN1 -HVU 0.1µ V=4 Irms=1.62 Rser=0.0464862 Lser=0 mfg="KEMET" pn="C0402C104K7PAC" type="X5R"
C_D4 -HVU HVLIN2 0.1µ V=4 Irms=1.62 Rser=0.0464862 Lser=0 mfg="KEMET" pn="C0402C104K7PAC" type="X5R"
V§LVLIN1 LVLIN1 0 SINE(0 {LVINPEAK} 50)
D5 LVLIN1 +LVU 1N5408
D6 LVLIN2 +LVU 1N5408
CFPLV +LVU 0 4700µ V=35 Irms=1.45 Rser=0.044 Lser=0 mfg="Nichicon" pn="UPR1V222MRH" type="Al electrolytic"
CFPLVHF +LVU 0 0.1µ V=4 Irms=1.62 Rser=0.0464862 Lser=0 mfg="KEMET" pn="C0402C104K7PAC" type="X5R"
D7 -LVU LVLIN1 1N5408
D8 -LVU LVLIN2 1N5408
V§LVLIN2 0 LVLIN2 SINE(0 {LVINPEAK} 50)
CFNLV 0 -LVU 4700µ V=35 Irms=1.45 Rser=0.044 Lser=0 mfg="Nichicon" pn="UPR1V222MRH" type="Al electrolytic"
CFNLVHF 0 -LVU 0.1µ V=4 Irms=1.62 Rser=0.0464862 Lser=0 mfg="KEMET" pn="C0402C104K7PAC" type="X5R"
C_D5 LVLIN1 +LVU 0.1µ V=4 Irms=1.62 Rser=0.0464862 Lser=0 mfg="KEMET" pn="C0402C104K7PAC" type="X5R"
C_D6 +LVU LVLIN2 0.1µ V=4 Irms=1.62 Rser=0.0464862 Lser=0 mfg="KEMET" pn="C0402C104K7PAC" type="X5R"
C_D7 LVLIN1 -LVU 0.1µ V=4 Irms=1.62 Rser=0.0464862 Lser=0 mfg="KEMET" pn="C0402C104K7PAC" type="X5R"
C_D8 -LVU LVLIN2 0.1µ V=4 Irms=1.62 Rser=0.0464862 Lser=0 mfg="KEMET" pn="C0402C104K7PAC" type="X5R"
Q1 +HVU N001 +HV 0 TIP41C
D15 +RHV +HV D1N4751
D17 -HV -RHV D1N4751
D18 +RLV vmidplreg D1N4751
D19 vmidplreg +HV D1N4751
D16 vmidnlreg -RLV D1N4751
D20 -HV vmidnlreg D1N4751
D21 0 VZ1 D1N4756
R9 +HVU VZ1 890
Q2 +HVU VZ1 N001 0 BC548B
R16 +HV N001 100
C11 VZ1 0 10µ
C24 +HV 0 100µ
C25 +HV 0 0.1µ
D22 VZ2 0 D1N4756
R17 -HVU VZ2 890
R18 -HV N003 100
C26 0 VZ2 10µ
C27 0 -HV 100µ
C28 -HV 0 0.1µ
Q4 -HVU VZ2 N003 0 BC558B
Q3 -HVU N003 -HV 0 TIP42C
.model D D
.lib standard.dio
.model NPN NPN
.model PNP PNP
.lib standard.bjt
* From transformer
.tran 0 100m 0 0.1m
.lib "1N4007.lib"
* Directives
.lib "1N5408.lib"
.lib "1N4751.lib"
.param HTRAFOEFF=40
.param LTRAFOEFF=12
.param LINELEVEL={MINLINELEVEL}
* Tensión de línea(220V):
* 180V a 240V => 0.818 a 1.091
.param MAXLINELEVEL=1.091
.param MINLINELEVEL=0.818
.param NORMALLINELEVEL=1
.param HVINPEAK=LINELEVEL*SQRT(2)*HTRAFOEFF
* From transformer
.param LVINPEAK=LINELEVEL*SQRT(2)*LTRAFOEFF
.lib "1N4756.lib"
.lib "BC548B.lib"
.lib "BC558B.lib"
.lib "TIP41C.lib"
.lib "TIP42C.lib"
.lib LM317_TRANS.LIB
.lib LM337_N_TRANS.LIB
.backanno
.end